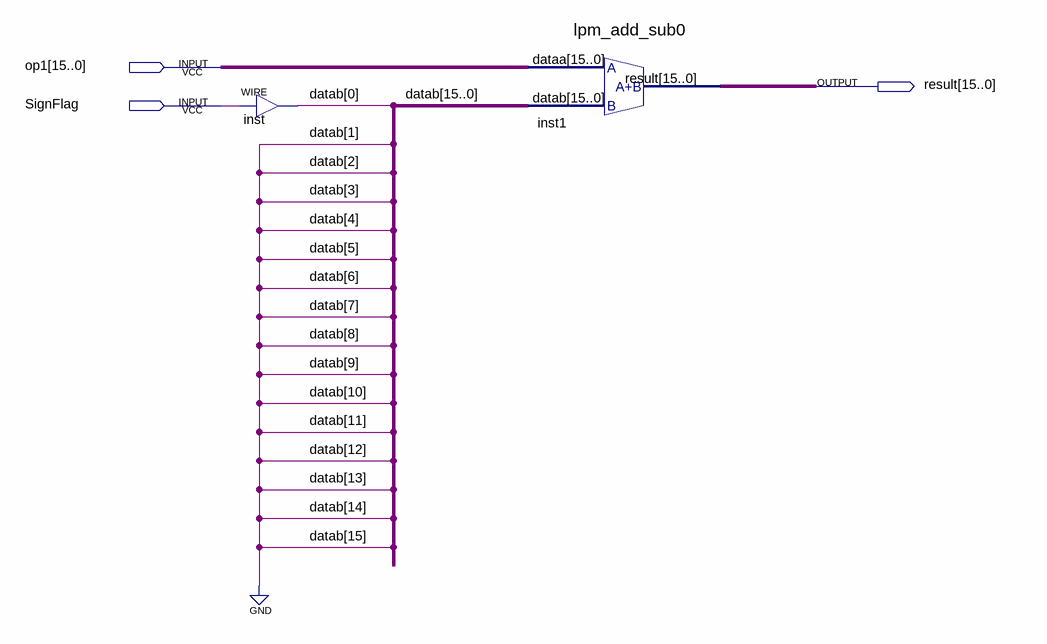
[diagram p0: schematic sheet]
// Quartus schematic sing_add.bdf as structural Verilog: 2 symbols, 3 pins
module sing_add (
  input  [15:0] op1,
  input  SignFlag,
  output [15:0] result
);

  wire [0:0] datab;

  assign datab[0] = SignFlag;  // WIRE inst
  lpm_add_sub0 inst1 (.dataa(op1), .datab({{15{1'b0}}, datab[0]}), .result(result));
endmodule
